# Altium project EEM_FMC_Carrier.PrjPCB (part 4 of 9)

## Sheet FPGA_Bank_0_Supplies.SchDoc: EEM FMC Carrier
size 420 x 297 mm; EDA_Number: ARTIQ; Projet: ARTIQ/Sinara; CheckedBy: -; CompanyName: WUT ISE; DrawnBy: Paweł Kulik; Organization: WUT ISE; Address1: Warsaw University of Technology; Address2: Nowowiejska 15/19 00-665 Warsaw; Address3: pawel.kulik@pw.edu.pl; DocumentNumber: 12; SheetNumber: 7; SheetTotal: 13; ModifiedBy: -; CheckedDate: -; Title2: FPGA power&caps + bank 0; DivGrp: ISE; Designer: Paweł Kulik; ModifiedDate: -; ProjectName: EEM_FMC_Carrier.PrjPCB
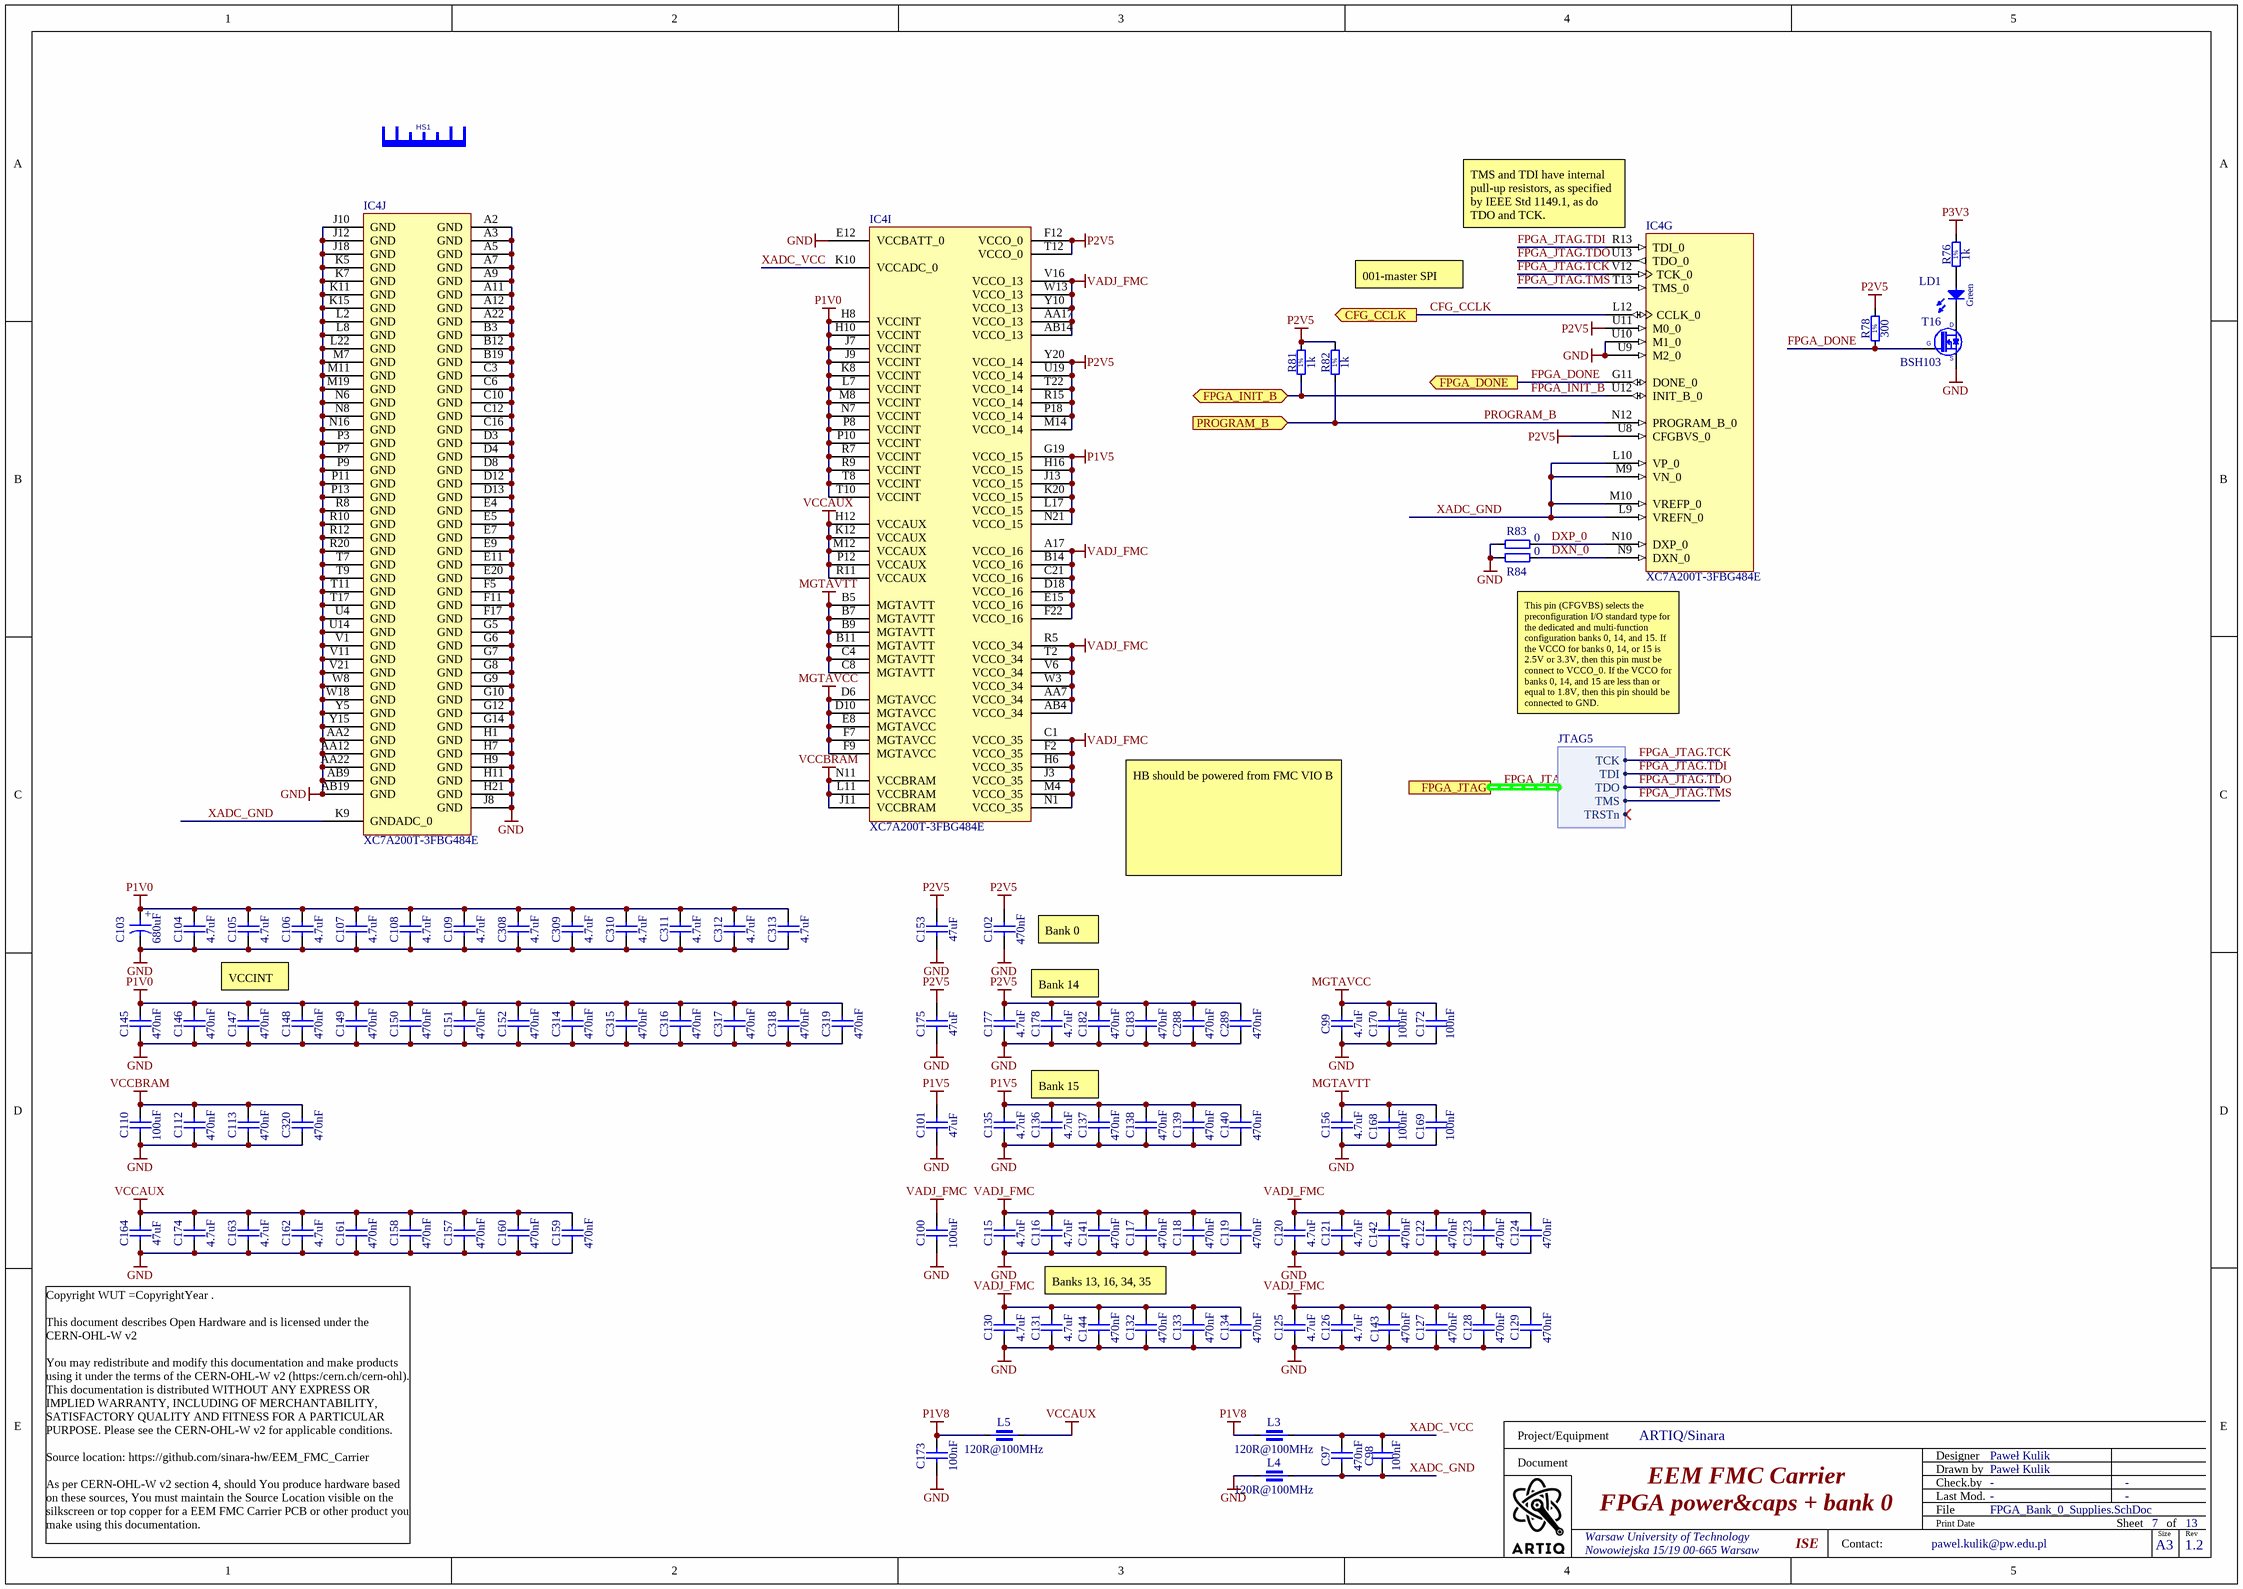
[diagram p5: FPGA_Bank_0_Supplies.SchDoc]

### Parts
C97  470nF  [CAPC0603X33N]
C98  100nF  [CAPC0603X33N]
C99  4.7uF  [CAPC1005X55N]
C100  100uF  [CAPC3216X180N]
C101  47uF  [CAPC1608X100N]
C102  470nF  [CAPC0603X33N]
C103  680uF  [CAPMP7343X430N]
C104  4.7uF  [CAPC1005X55N]
C105  4.7uF  [CAPC1005X55N]
C106  4.7uF  [CAPC1005X55N]
C107  4.7uF  [CAPC1005X55N]
C108  4.7uF  [CAPC1005X55N]
C109  4.7uF  [CAPC1005X55N]
C110  100uF  [CAPC3216X180N]
C112  470nF  [CAPC0603X33N]
C113  470nF  [CAPC0603X33N]
C115  4.7uF  [CAPC1005X55N]
C116  4.7uF  [CAPC1005X55N]
C117  470nF  [CAPC0603X33N]
C118  470nF  [CAPC0603X33N]
C119  470nF  [CAPC0603X33N]
C120  4.7uF  [CAPC1005X55N]
C121  4.7uF  [CAPC1005X55N]
C122  470nF  [CAPC0603X33N]
C123  470nF  [CAPC0603X33N]
C124  470nF  [CAPC0603X33N]
C125  4.7uF  [CAPC1005X55N]
C126  4.7uF  [CAPC1005X55N]
C127  470nF  [CAPC0603X33N]
C128  470nF  [CAPC0603X33N]
C129  470nF  [CAPC0603X33N]
C130  4.7uF  [CAPC1005X55N]
C131  4.7uF  [CAPC1005X55N]
C132  470nF  [CAPC0603X33N]
C133  470nF  [CAPC0603X33N]
C134  470nF  [CAPC0603X33N]
C135  4.7uF  [CAPC1005X55N]
C136  4.7uF  [CAPC1005X55N]
C137  470nF  [CAPC0603X33N]
C138  470nF  [CAPC0603X33N]
C139  470nF  [CAPC0603X33N]
C140  470nF  [CAPC0603X33N]
C141  470nF  [CAPC0603X33N]
C142  470nF  [CAPC0603X33N]
C143  470nF  [CAPC0603X33N]
C144  470nF  [CAPC0603X33N]
C145  470nF  [CAPC0603X33N]
C146  470nF  [CAPC0603X33N]
C147  470nF  [CAPC0603X33N]
C148  470nF  [CAPC0603X33N]
C149  470nF  [CAPC0603X33N]
C150  470nF  [CAPC0603X33N]
C151  470nF  [CAPC0603X33N]
C152  470nF  [CAPC0603X33N]
C153  47uF  [CAPC1608X100N]
C156  4.7uF  [CAPC1005X55N]
C157  470nF  [CAPC0603X33N]
C158  470nF  [CAPC0603X33N]
C159  470nF  [CAPC0603X33N]
C160  470nF  [CAPC0603X33N]
C161  470nF  [CAPC0603X33N]
C162  4.7uF  [CAPC1005X55N]
C163  4.7uF  [CAPC1005X55N]
C164  47uF  [CAPC1608X100N]
C168  100nF  [CAPC0603X33N]
C169  100nF  [CAPC0603X33N]
C170  100nF  [CAPC0603X33N]
C172  100nF  [CAPC0603X33N]
C173  100nF  [CAPC0603X33N]
C174  4.7uF  [CAPC1005X55N]
C175  47uF  [CAPC1608X100N]
C177  4.7uF  [CAPC1005X55N]
C178  4.7uF  [CAPC1005X55N]
C182  470nF  [CAPC0603X33N]
C183  470nF  [CAPC0603X33N]
C288  470nF  [CAPC0603X33N]
C289  470nF  [CAPC0603X33N]
C308  4.7uF  [CAPC1005X55N]
C309  4.7uF  [CAPC1005X55N]
C310  4.7uF  [CAPC1005X55N]
C311  4.7uF  [CAPC1005X55N]
C312  4.7uF  [CAPC1005X55N]
C313  4.7uF  [CAPC1005X55N]
C314  470nF  [CAPC0603X33N]
C315  470nF  [CAPC0603X33N]
C316  470nF  [CAPC0603X33N]
C317  470nF  [CAPC0603X33N]
C318  470nF  [CAPC0603X33N]
C319  470nF  [CAPC0603X33N]
C320  470nF  [CAPC0603X33N]
HS1  RADIAN_FI23  [RADIAN_FI23]  (value not drawn)
IC4  XC7A200T-3FBG484E  [BGA484C100P22X22_2300X2300X254]  (parts G,I,J of 10)
L3  120R@100MHz  [INDC1608X65N]
L4  120R@100MHz  [INDC1608X65N]
L5  120R@100MHz  [INDC1608X65N]
LD1  Green  [LED_KINGBRIGHT_KPH-1608CGCK]
R76  1k  [RESC1005X40N]
R78  300  [RESC1005X40N]
R81  1k  [RESC1005X40N]
R82  1k  [RESC1005X40N]
R83  0  [RESC0603X28N]
R84  0  [RESC0603X28N]
T16  BSH103  [SOT95P230X110-3N]

### Ports
CFG_CCLK (out), FPGA_DONE (out), FPGA_INIT_B (bidir), FPGA_JTAG (harness JTAG5), PROGRAM_B (in)

### Harnesses
JTAG5: TCK, TDI, TDO, TMS, TRSTn

### Nets
GND: C99.1 C100.1 C101.1 C102.1 C103.2 C104.1 C105.1 C106.1 C107.1 C108.1 C109.1 C110.1 C112.1 C113.1 C115.1 C116.1 C117.1 C118.1 C119.1 C120.1 C121.1 C122.1 C123.1 C124.1 C125.1 C126.1 C127.1 C128.1 C129.1 C130.1 C131.1 C132.1 C133.1 C134.1 C135.1 C136.1 C137.1 C138.1 C139.1 C140.1 C141.1 C142.1 C143.1 C144.1 C145.1 C146.1 C147.1 C148.1 C149.1 C150.1 C151.1 C152.1 C153.1 C156.1 C157.1 C158.1 C159.1 C160.1 C161.1 C162.1 C163.1 C164.1 C168.1 C169.1 C170.1 C172.1 C173.1 C174.1 C175.1 C177.1 C178.1 C182.1 C183.1 C288.1 C289.1 C308.1 C309.1 C310.1 C311.1 C312.1 C313.1 C314.1 C315.1 C316.1 C317.1 C318.1 C319.1 C320.1 IC4.A2(GND) IC4.A3(GND) IC4.A5(GND) IC4.A7(GND) IC4.A9(GND) IC4.A11(GND) IC4.A12(GND) IC4.A22(GND) IC4.AA2(GND) IC4.AA12(GND) IC4.AA22(GND) IC4.AB9(GND) IC4.AB19(GND) IC4.B3(GND) IC4.B12(GND) IC4.B19(GND) IC4.C3(GND) IC4.C6(GND) IC4.C10(GND) IC4.C12(GND) IC4.C16(GND) IC4.D3(GND) IC4.D4(GND) IC4.D8(GND) IC4.D12(GND) IC4.D13(GND) IC4.E4(GND) IC4.E5(GND) IC4.E7(GND) IC4.E9(GND) IC4.E11(GND) IC4.E12(VCCBATT_0) IC4.E20(GND) IC4.F5(GND) IC4.F11(GND) IC4.F17(GND) IC4.G5(GND) IC4.G6(GND) IC4.G7(GND) IC4.G8(GND) IC4.G9(GND) IC4.G10(GND) IC4.G12(GND) IC4.G14(GND) IC4.H1(GND) IC4.H7(GND) IC4.H9(GND) IC4.H11(GND) IC4.H21(GND) IC4.J8(GND) IC4.J10(GND) IC4.J12(GND) IC4.J18(GND) IC4.K5(GND) IC4.K7(GND) IC4.K11(GND) IC4.K15(GND) IC4.L2(GND) IC4.L8(GND) IC4.L22(GND) IC4.M7(GND) IC4.M11(GND) IC4.M19(GND) IC4.N6(GND) IC4.N8(GND) IC4.N16(GND) IC4.P3(GND) IC4.P7(GND) IC4.P9(GND) IC4.P11(GND) IC4.P13(GND) IC4.R8(GND) IC4.R10(GND) IC4.R12(GND) IC4.R20(GND) IC4.T7(GND) IC4.T9(GND) IC4.T11(GND) IC4.T17(GND) IC4.U4(GND) IC4.U9(M2_0) IC4.U10(M1_0) IC4.U14(GND) IC4.V1(GND) IC4.V11(GND) IC4.V21(GND) IC4.W8(GND) IC4.W18(GND) IC4.Y5(GND) IC4.Y15(GND) L4.1 R83.1 R84.1 T16.2(S)
MGTAVCC: C99.2 C170.2 C172.2 IC4.D6(MGTAVCC) IC4.D10(MGTAVCC) IC4.E8(MGTAVCC) IC4.F7(MGTAVCC) IC4.F9(MGTAVCC)
MGTAVTT: C156.2 C168.2 C169.2 IC4.B5(MGTAVTT) IC4.B7(MGTAVTT) IC4.B9(MGTAVTT) IC4.B11(MGTAVTT) IC4.C4(MGTAVTT) IC4.C8(MGTAVTT)
P1V0: C103.1 C104.2 C105.2 C106.2 C107.2 C108.2 C109.2 C145.2 C146.2 C147.2 C148.2 C149.2 C150.2 C151.2 C152.2 C308.2 C309.2 C310.2 C311.2 C312.2 C313.2 C314.2 C315.2 C316.2 C317.2 C318.2 C319.2 IC4.H8(VCCINT) IC4.H10(VCCINT) IC4.J7(VCCINT) IC4.J9(VCCINT) IC4.K8(VCCINT) IC4.L7(VCCINT) IC4.M8(VCCINT) IC4.N7(VCCINT) IC4.P8(VCCINT) IC4.P10(VCCINT) IC4.R7(VCCINT) IC4.R9(VCCINT) IC4.T8(VCCINT) IC4.T10(VCCINT)
P1V5: C101.2 C135.2 C136.2 C137.2 C138.2 C139.2 C140.2 IC4.G19(VCCO_15) IC4.H16(VCCO_15) IC4.J13(VCCO_15) IC4.K20(VCCO_15) IC4.L17(VCCO_15) IC4.N21(VCCO_15)
P1V8: C173.2 L3.1 L5.1
P2V5: C102.2 C153.2 C175.2 C177.2 C178.2 C182.2 C183.2 C288.2 C289.2 IC4.F12(VCCO_0) IC4.M14(VCCO_14) IC4.P18(VCCO_14) IC4.R15(VCCO_14) IC4.T12(VCCO_0) IC4.T22(VCCO_14) IC4.U8(CFGBVS_0) IC4.U11(M0_0) IC4.U19(VCCO_14) IC4.Y20(VCCO_14) R78.2 R81.2 R82.2
P3V3: R76.2
VADJ_FMC: C100.2 C115.2 C116.2 C117.2 C118.2 C119.2 C120.2 C121.2 C122.2 C123.2 C124.2 C125.2 C126.2 C127.2 C128.2 C129.2 C130.2 C131.2 C132.2 C133.2 C134.2 C141.2 C142.2 C143.2 C144.2 IC4.A17(VCCO_16) IC4.AA7(VCCO_34) IC4.AA17(VCCO_13) IC4.AB4(VCCO_34) IC4.AB14(VCCO_13) IC4.B14(VCCO_16) IC4.C1(VCCO_35) IC4.C21(VCCO_16) IC4.D18(VCCO_16) IC4.E15(VCCO_16) IC4.F2(VCCO_35) IC4.F22(VCCO_16) IC4.H6(VCCO_35) IC4.J3(VCCO_35) IC4.M4(VCCO_35) IC4.N1(VCCO_35) IC4.R5(VCCO_34) IC4.T2(VCCO_34) IC4.V6(VCCO_34) IC4.V16(VCCO_13) IC4.W3(VCCO_34) IC4.W13(VCCO_13) IC4.Y10(VCCO_13)
VCCAUX: C157.2 C158.2 C159.2 C160.2 C161.2 C162.2 C163.2 C164.2 C174.2 IC4.H12(VCCAUX) IC4.K12(VCCAUX) IC4.M12(VCCAUX) IC4.P12(VCCAUX) IC4.R11(VCCAUX) L5.2
VCCBRAM: C110.2 C112.2 C113.2 C320.2 IC4.J11(VCCBRAM) IC4.L11(VCCBRAM) IC4.N11(VCCBRAM)
CFG_CCLK: IC4.L12(CCLK_0) ; port CFG_CCLK
DXN_0: IC4.N9(DXN_0) R84.2
DXP_0: IC4.N10(DXP_0) R83.2
FPGA_DONE: IC4.G11(DONE_0) R78.1 T16.1(G) ; port FPGA_DONE
FPGA_INIT_B: IC4.U12(INIT_B_0) R81.1 ; port FPGA_INIT_B
FPGA_JTAG.TCK: IC4.V12(TCK_0) ; port FPGA_JTAG.TCK
FPGA_JTAG.TDI: IC4.R13(TDI_0) ; port FPGA_JTAG.TDI
FPGA_JTAG.TDO: IC4.U13(TDO_0) ; port FPGA_JTAG.TDO
FPGA_JTAG.TMS: IC4.T13(TMS_0) ; port FPGA_JTAG.TMS
PROGRAM_B: IC4.N12(PROGRAM_B_0) R82.1 ; port PROGRAM_B
XADC_GND: C97.1 C98.1 IC4.K9(GNDADC_0) IC4.L9(VREFN_0) IC4.L10(VP_0) IC4.M9(VN_0) IC4.M10(VREFP_0) L4.2
XADC_VCC: C97.2 C98.2 IC4.K10(VCCADC_0) L3.2
NetLD1_1: LD1.1(C) T16.3(D)
NetLD1_2: LD1.2(A) R76.1

### Buses and harness runs
harness FPGA_JTAG = port FPGA_JTAG

### Notes on the sheet
- (near IC4) TMS and TDI have internal pull-up resistors, as specified by IEEE Std 1149.1, as do TDO and TCK.
- 001-master SPI
- This pin (CFGVBS) selects the preconfiguration I/O standard type for the dedicated and multi-function configuration banks 0, 14, and 15. If the VCCO for banks 0, 14, or 15 is 2.5V or 3.3V, then this pin must be connect to VCCO_0. If the VCCO for banks 0, 14, and 15 are less than or equal to 1.8V, then this pin should be connected to GND.
- (near C102) Bank 0
- HB should be powered from FMC VIO B
- VCCINT
- Bank 14
- Bank 15
- Banks 13, 16, 34, 35
- Project/Equipment
- Document
- Designer
- Drawn by
- Check.by
- Copyright WUT =CopyrightYear .
  This document describes Open Hardware and is licensed under the CERN-OHL-W v2
  You may redistribute and modify this documentation and make products using it under the terms of the CERN-OHL-W v2 (https:/cern.ch/cern-ohl). This documentation is distributed WITHOUT ANY EXPRESS OR IMPLIED WARRANTY, INCLUDING OF MERCHANTABILITY, SATISFACTORY QUALITY AND FITNESS FOR A PARTICULAR PURPOSE. Please see the CERN-OHL-W v2 for applicable conditions.
  Source location: https://github.com/sinara-hw/EEM_FMC_Carrier
  As per CERN-OHL-W v2 section 4, should You produce hardware based on these sources, You must maintain the Source Location visible on the silkscreen or top copper for a EEM FMC Carrier PCB or other product you make using this documentation.
- Contact:
- File
- Last Mod.
- Print Date
- Sheet
- Size
- A3
- of
- Rev
- (in symbol CTE7343-43_680UF_6.3V_10%_LESR0018_AVX_TPM) +
- (in symbol R0402_1K_1%_0.0625W_100PPM) 1%
- (in symbol R0402_300R_1%_0.0625W_100PPM) 1%

### Library data of the parts
C97 C102 C112 C113 C117-C119 C122-C124 C127-C129 C132-C134 C137-C152 C157-C161 C182 C183 C288 C289 C314-C320 = CC0201_470NF_4V_20%_X5R: Non-polarised capacitor; Part Description: SMD Multilayer Chip Ceramic Capacitor; Manufacturer: GENERIC; Manufacturer1 Part Number: AMK063BJ474MP-F; Voltage: 4V; TC: X5R; Tolerance: ±20%; Part Number: CC0201_470NF_4V_20%_X5R; Component Kind: Standard; Component Type: Standard; Pin Count: 2; Value: 470nF; Status: Not Recommended; Manufacturer Part Number: CC0201_470NF_4V_20%_X5R; Case: 0201; Mounted: Yes; Socket: No; SMD: Yes; Sense: No; Manufacturer1 Example: TAIYO YUDEN; Manufacturer1 ComponentHeight: 0.33mm; HelpURL: \\cern.ch\dfs\Applications\Altium\Datasheets\CC0201_X5R_TAIYO-YUDEN_STANDARD-CLASS2.pdf; Author: CERN DEM JLC; CreateDate: 27.05.2010; LatestRevisionDate: 27.05.2010
  C113 C117 C122 C127 C132 C138 C148 C159 C183 C315 C320: ClassName: Artix
C98 C168-C170 C172 C173 = CC0201_100NF_6.3V_10%_X5R: as C33-C36 on sheet CLK_Distribution; Part Number: CC0201_100NF_6.3V_10%_X5R; Component Kind: Standard; Component Type: Standard; Pin Count: 2; Value: 100nF; Status: Not Recommended; Manufacturer Part Number: CC0201_100NF_6.3V_10%_X5R; Case: 0201; Mounted: Yes; Socket: No; SMD: Yes; Sense: No; Manufacturer1 Example: AVX; Manufacturer1 ComponentHeight: 0.33mm; HelpURL: \\cern.ch\dfs\Applications\Altium\Datasheets\CC0201_X5R_AVX.pdf; Author: CERN DEM JLC
  C98 C168-C170 C172: CreateDate: 2007-12-03; LatestRevisionDate: 2007-12-03; ClassName: Artix
  C173: CreateDate: 03.12.2007; LatestRevisionDate: 03.12.2007
C99 C156 C174 = CC0402_4.7UF_6.3V_20%_X5R: Non-polarised capacitor; Part Description: SMD Multilayer Chip Ceramic Capacitor; Manufacturer: GENERIC; Manufacturer1 Part Number: C1005X5R0J475M050BC; Voltage: 6.3V; TC: X5R; Tolerance: ±20%; Part Number: CC0402_4.7UF_6.3V_20%_X5R; Component Kind: Standard; Component Type: Standard; Pin Count: 2; Value: 4.7uF; Status: Preferred; Manufacturer Part Number: CC0402_4.7UF_6.3V_20%_X5R; Case: 0402; Mounted: Yes; Socket: No; SMD: Yes; Sense: No; Manufacturer1 Example: TDK; Manufacturer1 ComponentHeight: 0.65mm; HelpURL: \\cern.ch\dfs\Applications\Altium\Datasheets\CC0402_X5R_TDK_C.pdf; Author: CERN DEM JLC; CreateDate: 03.03.2015; LatestRevisionDate: 03.03.2015
C100 C110 = CC1206_100UF_6.3V_20%_X5R: Non-polarised capacitor; Part Description: SMD Multilayer Chip Ceramic Capacitor; Manufacturer: GENERIC; Manufacturer1 Part Number: C1206C107M9PACTU; Voltage: 6.3V; TC: X5R; Tolerance: ±10%; Part Number: CC1206_100UF_6.3V_20%_X5R; Component Kind: Standard; Component Type: Standard; Pin Count: 2; Value: 100uF; Status: None; Manufacturer Part Number: CC1206_100UF_6.3V_20%_X5R; Case: 1206; Mounted: Yes; Socket: No; SMD: Yes; Sense: No; Manufacturer1 Example: KEMET; Manufacturer1 ComponentHeight: 1.8mm; HelpURL: \\cern.ch\dfs\Applications\Altium\Datasheets\CC1206_X5R_KEMET.pdf; Author: CERN DEM JLC; CreateDate: 26.09.2012; LatestRevisionDate: 26.09.2012
C101 C153 C164 C175 = CC0603_47UF_6.3V_20%_X5R: Non-polarised capacitor; Part Description: SMD Multilayer Chip Ceramic Capacitor; Manufacturer: GENERIC; Manufacturer1 Part Number: GRM188R60J476ME15D; Voltage: 6.3V; TC: X5R; Tolerance: ±20%; Part Number: CC0603_47UF_6.3V_20%_X5R; Component Kind: Standard; Component Type: Standard; Pin Count: 2; Value: 47uF; Status: None; Manufacturer Part Number: CC0603_47UF_6.3V_20%_X5R; Case: 0603; Mounted: Yes; Socket: No; SMD: Yes; Sense: No; Manufacturer1 Example: MURATA; Manufacturer1 ComponentHeight: 1mm; HelpURL: \\cern.ch\dfs\Applications\Altium\Datasheets\CC0603_MURATA_GRM188R60J476ME15D.pdf; Author: CERN DEM JLC; CreateDate: 01.02.2018; LatestRevisionDate: 01.02.2018
C103 = CTE7343-43_680UF_6.3V_10%_LESR0018_AVX_TPM: Polarised capacitor; Part Description: Ultra Low ESR 0R018 Multianode Tantalum Chip Capacitor; Manufacturer: AVX; Manufacturer Part Number: TPME687K006R0018; Voltage: 6.3V; Tolerance: ±10%; Part Number: CTE7343-43_680UF_6.3V_10%_LESR0018_AVX_TPM; Component Kind: Standard; Component Type: Standard; Pin Count: 2; Value: 680uF; Status: None; Case: E; Mounted: Yes; Socket: No; SMD: Yes; Sense: No; ComponentHeight: 4.3mm; HelpURL: \\cern.ch\dfs\Applications\Altium\Datasheets\CTE_AVX_TPM.pdf; Author: CERN DEM JLC; CreateDate: 13.10.2011; LatestRevisionDate: 13.10.2011
C104-C109 C115 C116 C120 C121 C125 C126 C130 C131 C135 C136 C162 C163 C177 C178 C308-C313 = CC0402_4.7UF_6.3V_20%_X5R: Non-polarised capacitor; Manufacturer: GENERIC; Part Description: SMD Multilayer Chip Ceramic Capacitor; Manufacturer1 Part Number: C1005X5R0J475M050BC; Voltage: 6.3V; TC: X5R; Tolerance: ±20%; Part Number: CC0402_4.7UF_6.3V_20%_X5R; Component Kind: Standard; Component Type: Standard; Pin Count: 2; Value: 4.7uF; Status: Preferred; Manufacturer Part Number: CC0402_4.7UF_6.3V_20%_X5R; Case: 0402; Mounted: Yes; Socket: No; SMD: Yes; Sense: No; Manufacturer1 Example: TDK; Manufacturer1 ComponentHeight: 0.65mm; HelpURL: \\cern.ch\dfs\Applications\Altium\Datasheets\CC0402_X5R_TDK_C.pdf; Author: CERN DEM JLC; CreateDate: 03.03.2015; LatestRevisionDate: 03.03.2015
HS1 = RADIAN_FI23: Heat Sink Without Pad; Manufacturer: Radian Thermal Products, Inc.; Manufacturer Part Number: FI23+BU+T725; Part Description: 23 x 23 x 16 mm, clip on heatsink with fan for IC design BGA and others; ComponentHeight: 16 mm; HelpURL: https://www.radianheatsinks.com/product/fi23/
IC4 = XC7A200T-3FBG484E: Artix-7 FPGA, 285 User I/Os, 4 GTP, 484-Ball BGA, Pb-Free; Manufacturer Part Number: XC7A200T-3FBG484E; Device: XC7A200T-3FBG484E
L3-L5 = IND0603_MURATA_BLM18SG121TN1D: Part Description: SMD EMIFIL Suppression Chip Ferrite Bead; Manufacturer: MURATA; Power: 3A; Resistance: 0.025R; Tolerance: ±25%; Part Number: IND0603_MURATA_BLM18SG121TN1D; Component Kind: Standard; Component Type: Standard; Pin Count: 2; Value: 120R@100MHz; Status: None; Manufacturer Part Number: BLM18SG121TN1D; Case: 0603; Mounted: Yes; Socket: No; SMD: Yes; Sense: No; ComponentHeight: 0.65mm; HelpURL: \\cern.ch\dfs\Applications\Altium\Datasheets\IND0603_MURATA_BLM18S.pdf; Author: CERN DEM JLC; CreateDate: 23.07.2014; LatestRevisionDate: 25.10.2018
LD1 = LED_KINGBRIGHT_KPH-1608CGCK: LED Green 1C 2A; Part Description: SMD Green LED, Case 1.6mmX0.8mm(0603), 0.65mm Thickness; PressFit: No; Bonding: No; Manufacturer Part Number: KPH-1608CGCK; ComponentHeight: 0.65mm; HelpURL: \\cern.ch\dfs\Applications\Altium\Datasheets\LED_KINGBRIGHT_KPH-1608CGCK.pdf; Part Number: LED_KINGBRIGHT_KPH-1608CGCK; Component Kind: Standard; Component Type: Standard; Color: Green; PackageDescription: SMT Green LED, Case 0603, Body L 1.6 x W 0.8mm H 0.65mm; Manufacturer: KINGBRIGHT; Pin Count: 2; Mounted: Yes; Socket: No; SMD: Yes; Sense: No; Author: CERN DEM JLC; CreateDate: 03.07.2017; LatestRevisionDate: 03.07.2017
R76 R81 R82 = R0402_1K_1%_0.0625W_100PPM: Resistor - 1%; Part Description: General Purpose Thick Film Chip Resistor; Manufacturer: GENERIC; Manufacturer1 Part Number: 232270671002L; TC: ±100ppm/°C; PressFit: No; Part Number: R0402_1K_1%_0.0625W_100PPM; Component Kind: Standard; Component Type: Standard; Pin Count: 2; Value: 1k; Status: Not Recommended; Power: 0.0625W; Tolerance: ±1%; Manufacturer Part Number: R0402_1K_1%_0.0625W_100PPM; Case: 0402; Mounted: Yes; Sense: No; Socket: No; SMD: Yes; Manufacturer1 Example: YAGEO PHYCOMP; Manufacturer1 ComponentHeight: 0.4mm; HelpURL: \\cern.ch\dfs\Applications\Altium\Datasheets\R0402_Phycomp_RC0402.pdf; Author: CERN DEM JLC; CreateDate: 03.12.2007; LatestRevisionDate: 17.10.2012; ClassName: Artix
R78 = R0402_300R_1%_0.0625W_100PPM: Resistor - 1%; Part Description: General Purpose Thick Film Chip Resistor; Manufacturer: GENERIC; Manufacturer1 Part Number: 232270673001L; TC: ±100ppm/°C; PressFit: No; Part Number: R0402_300R_1%_0.0625W_100PPM; Component Kind: Standard; Component Type: Standard; Pin Count: 2; Value: 300; Status: Not Recommended; Power: 0.0625W; Tolerance: ±1%; Manufacturer Part Number: R0402_300R_1%_0.0625W_100PPM; Case: 0402; Mounted: Yes; Sense: No; Socket: No; SMD: Yes; Manufacturer1 Example: YAGEO PHYCOMP; Manufacturer1 ComponentHeight: 0.4mm; HelpURL: \\cern.ch\dfs\Applications\Altium\Datasheets\R0402_Phycomp_RC0402.pdf; Author: CERN DEM JLC; CreateDate: 03.12.2007; LatestRevisionDate: 17.10.2012
R83 R84 = R0201_0R_JUMPER: Resistor; Part Description: 1A (0.05R Max DC Resistance) Zero Ohm Jumper; Manufacturer: GENERIC; Manufacturer1 Part Number: CRCW02010000Z0ED; PressFit: No; Part Number: R0201_0R_JUMPER; Component Kind: Standard; Component Type: Standard; Pin Count: 2; Value: 0; Status: Not Recommended; Manufacturer Part Number: R0201_0R_JUMPER; Case: 0201; Mounted: Yes; Sense: No; Socket: No; SMD: Yes; Manufacturer1 Example: VISHAY; Manufacturer1 ComponentHeight: 0.27mm; HelpURL: \\cern.ch\dfs\Applications\Altium\Datasheets\R0201_VISHAY_CRCW e3.pdf; Author: CERN DEM JLC; CreateDate: 19.11.2014; LatestRevisionDate: 08.01.2015
T16 = BSH103: N-CHANNEL MOSFET WITH DIODE; Part Description: 30V 850mA N-Channel Enhancement Mode Field-Effect Transistor; Manufacturer: NEXPERIA; PressFit: No; Bonding: No; Part Number: BSH103; Component Kind: Standard; Component Type: Standard; Device: BSH103; PackageDescription: SOT23, 0.95mm Pitch; 3 Pin, 1.30mm W X 2.90mm L X 1.10mm H body, IPC Medium Density; Manufacturer Part Number: BSH103; Pin Count: 3; Case: SOT23-3; Mounted: Yes; Socket: No; SMD: Yes; Sense: No; ComponentHeight: 1.1mm; HelpURL: \\cern.ch\dfs\Applications\Altium\Datasheets\BSH103.pdf; Author: CERN DEM JLC; CreateDate: 16.03.2010; LatestRevisionDate: 20.06.2017

## Sheet FPGA_GTP.SchDoc: EEM FMC Carrier
size 420 x 297 mm; EDA_Number: ARTIQ; Projet: ARTIQ/Sinara; CheckedBy: -; CompanyName: WUT ISE; DrawnBy: Paweł Kulik; Organization: WUT ISE; Address1: Warsaw University of Technology; Address2: Nowowiejska 15/19 00-665 Warsaw; Address3: pawel.kulik@pw.edu.pl; DocumentNumber: 13; SheetNumber: 4; SheetTotal: 13; CheckedDate: -; Title2: FPGA GTP; DivGrp: ISE; Designer: Paweł Kulik; ModifiedDate: -; ProjectName: EEM_FMC_Carrier.PrjPCB
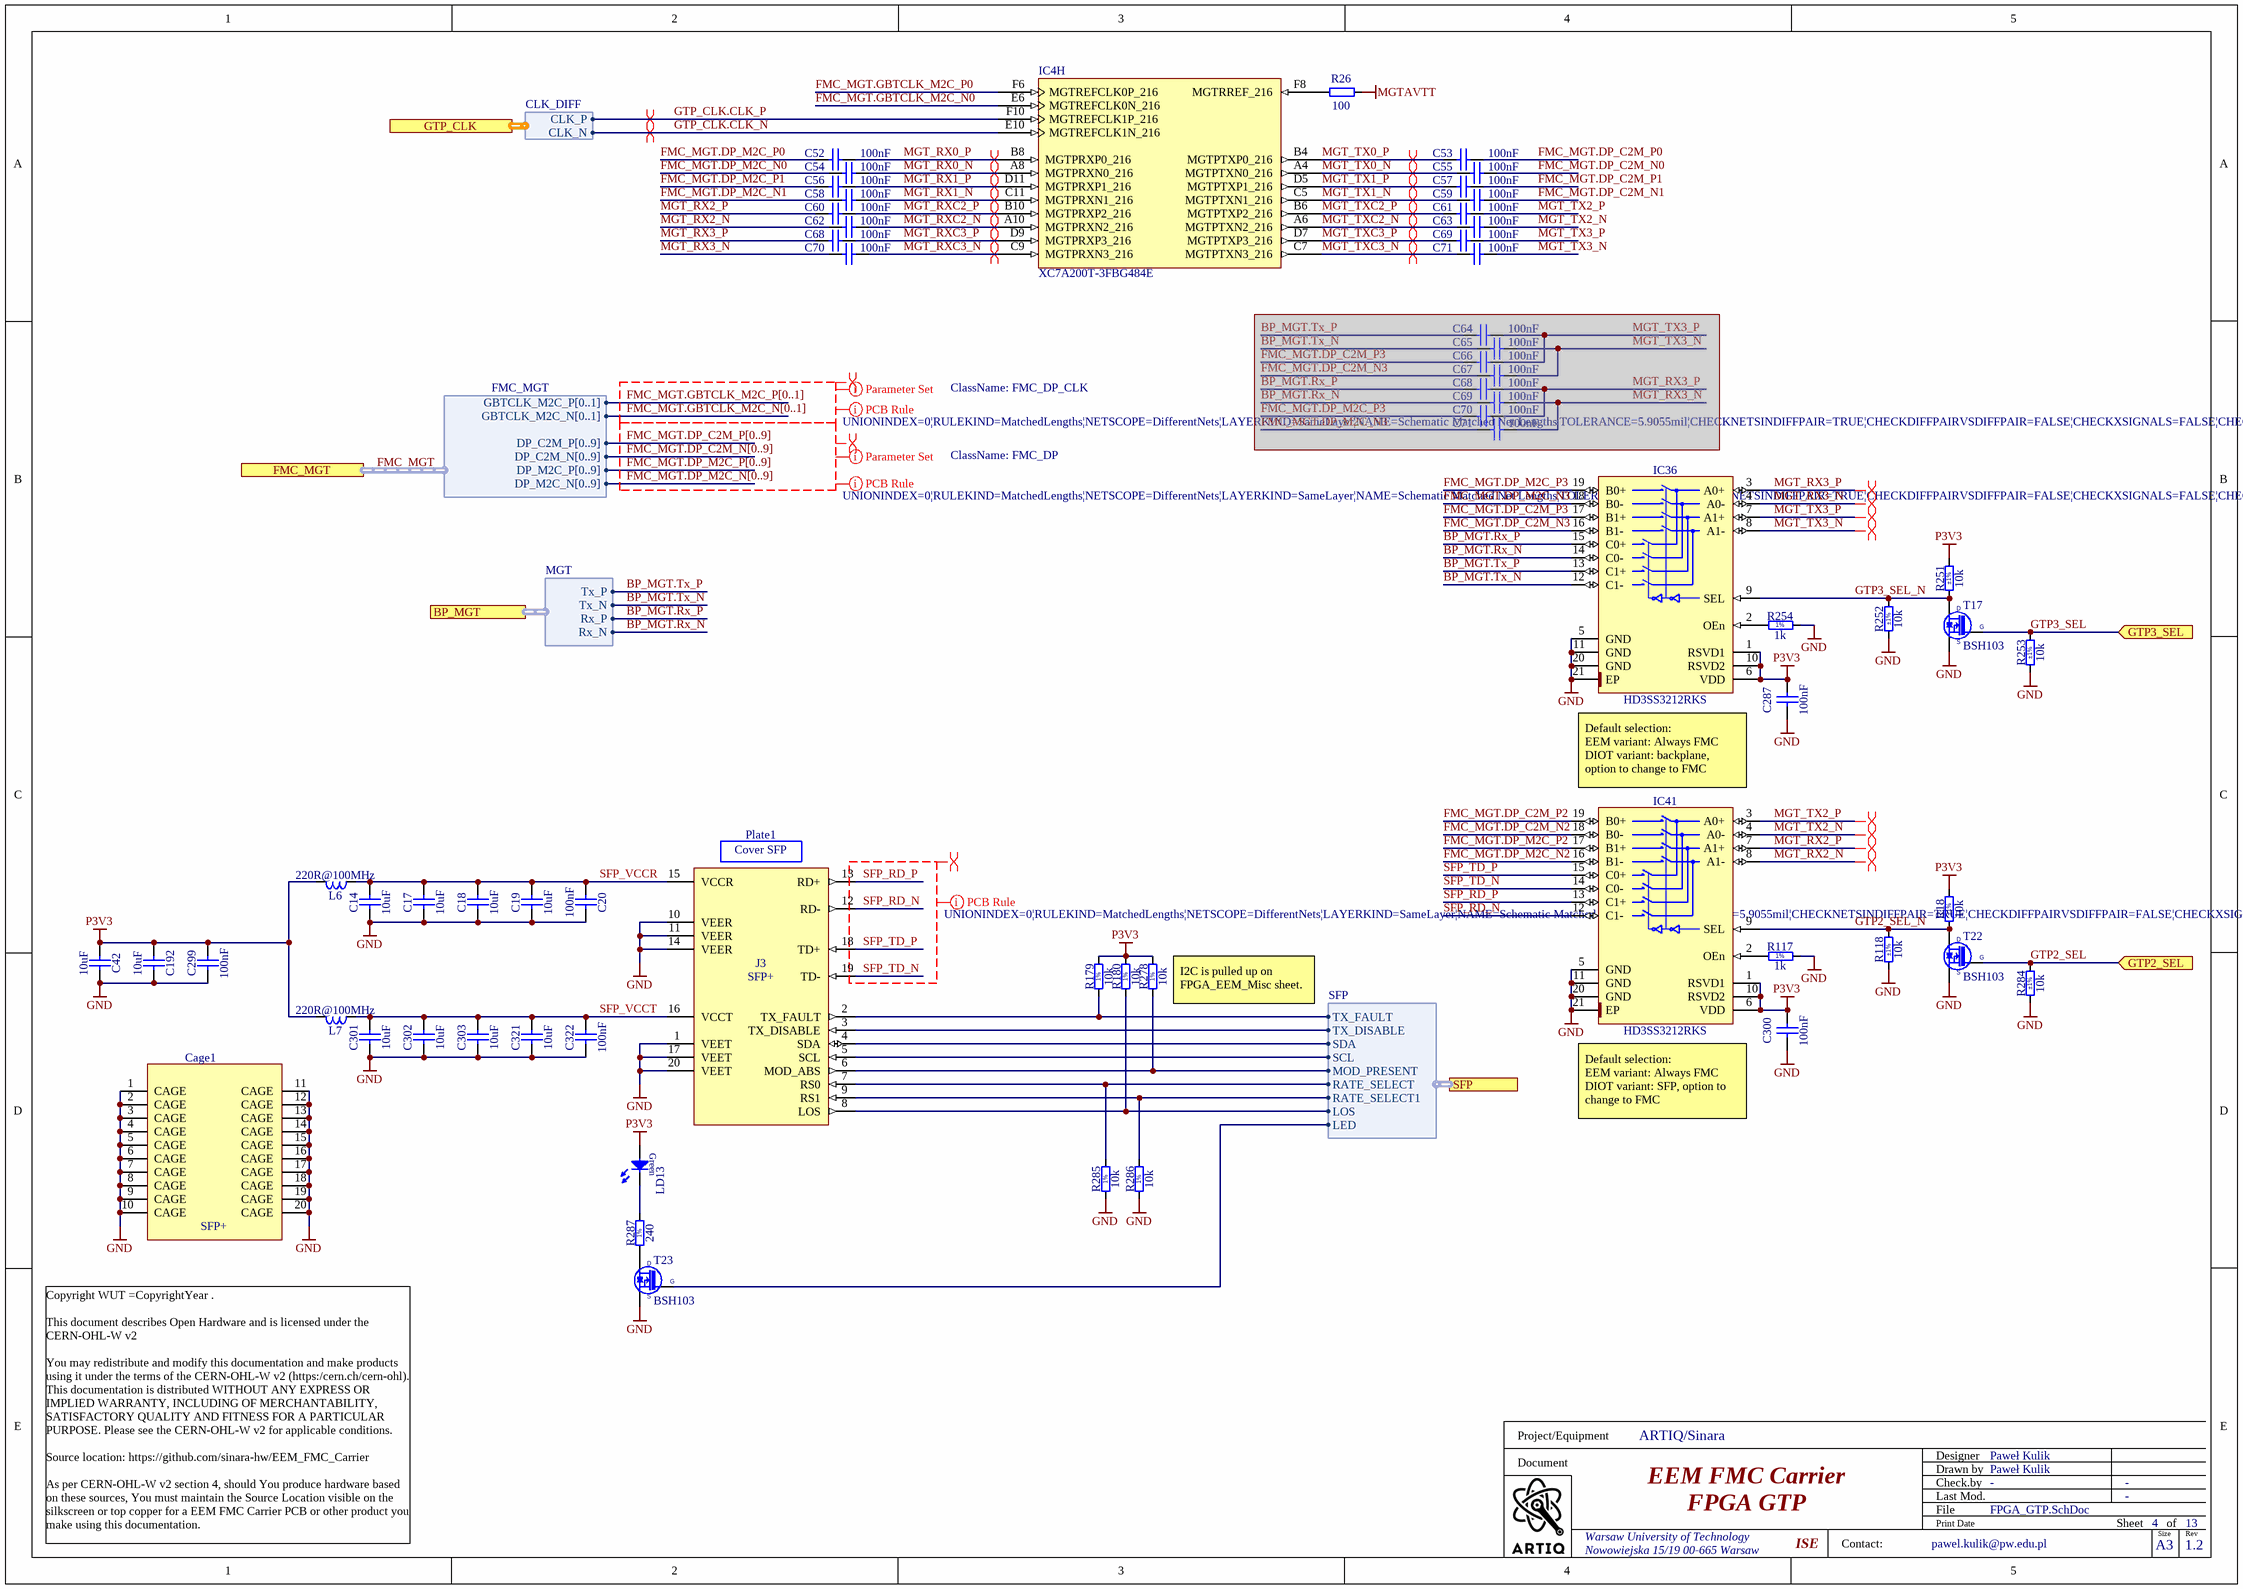
[diagram p6: FPGA_GTP.SchDoc]

### Parts
(Parts that share a designator on the sheet are numbered #1, #2 ... from top to bottom, then left to right.)
C14  10uF  [CAPC1005X70N]
C17  10uF  [CAPC1005X70N]
C18  10uF  [CAPC1005X70N]
C19  10uF  [CAPC1005X70N]
C20  100nF  [CAPC1005X55N]
C42  10uF  [CAPC1005X70N]
C52  100nF  [CAPC0603X33N]
C53  100nF  [CAPC0603X33N]
C54  100nF  [CAPC0603X33N]
C55  100nF  [CAPC0603X33N]
C56  100nF  [CAPC0603X33N]
C57  100nF  [CAPC0603X33N]
C58  100nF  [CAPC0603X33N]
C59  100nF  [CAPC0603X33N]
C60  100nF  [CAPC0603X33N]
C61  100nF  [CAPC0603X33N]
C62  100nF  [CAPC0603X33N]
C63  100nF  [CAPC0603X33N]
C64#2  100nF  [CAPC0603X33N]  (masked out: inside a compile mask, not in the netlist)
C65#2  100nF  [CAPC0603X33N]  (masked out: inside a compile mask, not in the netlist)
C66#2  100nF  [CAPC0603X33N]  (masked out: inside a compile mask, not in the netlist)
C67#2  100nF  [CAPC0603X33N]  (masked out: inside a compile mask, not in the netlist)
C68#1  100nF  [CAPC0603X33N]
C68#2  100nF  [CAPC0603X33N]  (masked out: inside a compile mask, not in the netlist)
C69#1  100nF  [CAPC0603X33N]
C69#2  100nF  [CAPC0603X33N]  (masked out: inside a compile mask, not in the netlist)
C70#1  100nF  [CAPC0603X33N]
C70#2  100nF  [CAPC0603X33N]  (masked out: inside a compile mask, not in the netlist)
C71#1  100nF  [CAPC0603X33N]
C71#2  100nF  [CAPC0603X33N]  (masked out: inside a compile mask, not in the netlist)
C192  10uF  [CAPC1005X70N]
C287  100nF  [CAPC1005X55N]
C299  100nF  [CAPC1005X55N]
C300  100nF  [CAPC1005X55N]
C301  10uF  [CAPC1005X70N]
C302  10uF  [CAPC1005X70N]
C303  10uF  [CAPC1005X70N]
C321  10uF  [CAPC1005X70N]
C322  100nF  [CAPC1005X55N]
Cage1  SFP+  [TYCO_2007198-1]
IC4  XC7A200T-3FBG484E  [BGA484C100P22X22_2300X2300X254]  (part H of 10)
IC36  HD3SS3212RKS  [TEXAS_RKS0020A]
IC41  HD3SS3212RKS  [TEXAS_RKS0020A]
J3  SFP+  [TYCO_1888247-1]
L6  220R@100MHz  [INDC2012X105N]
L7  220R@100MHz  [INDC2012X105N]
LD13  Green  [LED_AVAGO_HSME-C120]  (value not drawn)
Plate1  Cover SFP  [AMPHENOL_U77A11108000P]
R18  10k  Tolerance: ±1%  [RESC1005X40N]
R26  100  [RESC0603X28N]
R117  1k  [RESC1005X40N]
R118  10k  Tolerance: ±1%  [RESC1005X40N]
R179  10k  [RESC1005X40N]
R180  10k  [RESC1005X40N]
R251  10k  Tolerance: ±1%  [RESC1005X40N]
R252  10k  Tolerance: ±1%  [RESC1005X40N]
R253  10k  Tolerance: ±1%  [RESC1005X40N]
R254  1k  [RESC1005X40N]
R278  10k  [RESC1005X40N]
R284  10k  Tolerance: ±1%  [RESC1005X40N]
R285  10k  [RESC1005X40N]
R286  10k  [RESC1005X40N]
R287  240  [RESC1005X40N]
T17  BSH103  [SOT95P230X110-3N]
T22  BSH103  [SOT95P230X110-3N]
T23  BSH103  [SOT95P230X110-3N]

### Ports
BP_MGT (harness MGT), FMC_MGT (harness FMC_MGT), GTP2_SEL (in), GTP3_SEL (in), GTP_CLK (harness CLK_DIFF), SFP (harness SFP)

### Harnesses
FMC_MGT: GBTCLK_M2C_P[0..1], GBTCLK_M2C_N[0..1], DP_C2M_P[0..9], DP_C2M_N[0..9], DP_M2C_N[0..9], DP_M2C_P[0..9]
MGT: Tx_P, Tx_N, Rx_P, Rx_N
CLK_DIFF: CLK_P, CLK_N
SFP: TX_FAULT, LOS, MOD_PRESENT, TX_DISABLE, RATE_SELECT, LED, RATE_SELECT1, SDA, SCL

### Nets
GND: C14.1 C17.1 C18.1 C19.1 C20.2 C42.1 C192.1 C287.1 C299.2 C300.1 C301.1 C302.1 C303.1 C321.1 C322.2 Cage1.1(CAGE) Cage1.2(CAGE) Cage1.3(CAGE) Cage1.4(CAGE) Cage1.5(CAGE) Cage1.6(CAGE) Cage1.7(CAGE) Cage1.8(CAGE) Cage1.9(CAGE) Cage1.10(CAGE) Cage1.11(CAGE) Cage1.12(CAGE) Cage1.13(CAGE) Cage1.14(CAGE) Cage1.15(CAGE) Cage1.16(CAGE) Cage1.17(CAGE) Cage1.18(CAGE) Cage1.19(CAGE) Cage1.20(CAGE) IC36.5(GND) IC36.11(GND) IC36.20(GND) IC36.21(EP) IC41.5(GND) IC41.11(GND) IC41.20(GND) IC41.21(EP) J3.1(VEET) J3.10(VEER) J3.11(VEER) J3.14(VEER) J3.17(VEET) J3.20(VEET) R117.2 R118.1 R252.1 R253.1 R254.2 R284.1 R285.1 R286.1 T17.2(S) T22.2(S) T23.2(S)
MGTAVTT: R26.1
P3V3: C42.2 C192.2 C287.2 C299.1 C300.2 IC36.1(RSVD1) IC36.6(VDD) IC36.10(RSVD2) IC41.1(RSVD1) IC41.6(VDD) IC41.10(RSVD2) L6.2 L7.2 LD13.2(A) R18.2 R179.2 R180.2 R251.2 R278.2
Board_I2C.SCL: J3.4(SDA) ; port SFP.SDA
Board_I2C.SDA: J3.5(SCL) ; port SFP.SCL
BP_MGT.Rx_N: IC36.14(C0-) ; port BP_MGT.Rx_N
BP_MGT.Rx_P: IC36.15(C0+) ; port BP_MGT.Rx_P
BP_MGT.Tx_N: IC36.12(C1-) ; port BP_MGT.Tx_N
BP_MGT.Tx_P: IC36.13(C1+) ; port BP_MGT.Tx_P
FMC_MGT.DP_C2M_N0: C55.2
FMC_MGT.DP_C2M_N1: C59.2
FMC_MGT.DP_C2M_N2: IC41.18(B0-)
FMC_MGT.DP_C2M_N3: IC36.16(B1-)
FMC_MGT.DP_C2M_P0: C53.2
FMC_MGT.DP_C2M_P1: C57.2
FMC_MGT.DP_C2M_P2: IC41.19(B0+)
FMC_MGT.DP_C2M_P3: IC36.17(B1+)
FMC_MGT.DP_M2C_N0: C54.1
FMC_MGT.DP_M2C_N1: C58.1
FMC_MGT.DP_M2C_N2: IC41.16(B1-)
FMC_MGT.DP_M2C_N3: IC36.18(B0-)
FMC_MGT.DP_M2C_P0: C52.1
FMC_MGT.DP_M2C_P1: C56.1
FMC_MGT.DP_M2C_P2: IC41.17(B1+)
FMC_MGT.DP_M2C_P3: IC36.19(B0+)
FMC_MGT.GBTCLK_M2C_N0: IC4.E6(MGTREFCLK0N_216)
FMC_MGT.GBTCLK_M2C_P0: IC4.F6(MGTREFCLK0P_216)
GTP2_SEL: R284.2 T22.1(G) ; port GTP2_SEL
GTP2_SEL_N: IC41.9(SEL) R18.1 R118.2 T22.3(D)
GTP3_SEL: R253.2 T17.1(G) ; port GTP3_SEL
GTP3_SEL_N: IC36.9(SEL) R251.1 R252.2 T17.3(D)
GTP_CLK.CLK_N: IC4.E10(MGTREFCLK1N_216) ; port GTP_CLK.CLK_N
GTP_CLK.CLK_P: IC4.F10(MGTREFCLK1P_216) ; port GTP_CLK.CLK_P
MGT_RX0_N: C54.2 IC4.A8(MGTPRXN0_216)
MGT_RX0_P: C52.2 IC4.B8(MGTPRXP0_216)
MGT_RX1_N: C58.2 IC4.C11(MGTPRXN1_216)
MGT_RX1_P: C56.2 IC4.D11(MGTPRXP1_216)
MGT_RX2_N: C62.1 IC41.8(A1-)
MGT_RX2_P: C60.1 IC41.7(A1+)
MGT_RX3_N: C70#1.1 IC36.4(A0-)
MGT_RX3_P: C68#1.1 IC36.3(A0+)
MGT_RXC2_N: C62.2 IC4.A10(MGTPRXN2_216)
MGT_RXC2_P: C60.2 IC4.B10(MGTPRXP2_216)
MGT_RXC3_N: C70#1.2 IC4.C9(MGTPRXN3_216)
MGT_RXC3_P: C68#1.2 IC4.D9(MGTPRXP3_216)
MGT_TX0_N: C55.1 IC4.A4(MGTPTXN0_216)
MGT_TX0_P: C53.1 IC4.B4(MGTPTXP0_216)
MGT_TX1_N: C59.1 IC4.C5(MGTPTXN1_216)
MGT_TX1_P: C57.1 IC4.D5(MGTPTXP1_216)
MGT_TX2_N: C63.2 IC41.4(A0-)
MGT_TX2_P: C61.2 IC41.3(A0+)
MGT_TX3_N: C71#1.2 IC36.8(A1-)
MGT_TX3_P: C69#1.2 IC36.7(A1+)
MGT_TXC2_N: C63.1 IC4.A6(MGTPTXN2_216)
MGT_TXC2_P: C61.1 IC4.B6(MGTPTXP2_216)
MGT_TXC3_N: C71#1.1 IC4.C7(MGTPTXN3_216)
MGT_TXC3_P: C69#1.1 IC4.D7(MGTPTXP3_216)
SFP.LED: T23.1(G) ; port SFP.LED
SFP.LOS: J3.8(LOS) R180.1 ; port SFP.LOS
SFP.MOD_PRESENT: J3.6(MOD_ABS) R278.1 ; port SFP.MOD_PRESENT
SFP.RATE_SELECT: J3.7(RS0) R285.2 ; port SFP.RATE_SELECT
SFP.RATE_SELECT1: J3.9(RS1) R286.2 ; port SFP.RATE_SELECT1
SFP.TX_DISABLE: J3.3(TX_DISABLE) ; port SFP.TX_DISABLE
SFP.TX_FAULT: J3.2(TX_FAULT) R179.1 ; port SFP.TX_FAULT
SFP_RD_N: IC41.12(C1-) J3.12(RD-)
SFP_RD_P: IC41.13(C1+) J3.13(RD+)
SFP_TD_N: IC41.14(C0-) J3.19(TD-)
SFP_TD_P: IC41.15(C0+) J3.18(TD+)
SFP_VCCR: C14.2 C17.2 C18.2 C19.2 C20.1 J3.15(VCCR) L6.1
SFP_VCCT: C301.2 C302.2 C303.2 C321.2 C322.1 J3.16(VCCT) L7.1
NetIC4_F8: IC4.F8(MGTRREF_216) R26.2
NetIC36_2: IC36.2(OEn) R254.1
NetIC41_2: IC41.2(OEn) R117.1
NetLD13_1: LD13.1(C) R287.2
NetR287_1: R287.1 T23.3(D)

### Buses and harness runs
bus FMC_MGT.DP_C2M_N[0..9]
bus FMC_MGT.DP_C2M_P[0..9]
bus FMC_MGT.DP_M2C_N[0..9]
bus FMC_MGT.DP_M2C_P[0..9]
bus FMC_MGT.GBTCLK_M2C_N[0..1]
bus FMC_MGT.GBTCLK_M2C_P[0..1]
harness FMC_MGT = port FMC_MGT

### Layout directives
differential pair; differential pair class MGT: FMC_MGT.DP_C2M_N[0..9], FMC_MGT.DP_C2M_P[0..9], FMC_MGT.DP_M2C_N[0..9], FMC_MGT.DP_M2C_P[0..9], MGT_RX0_N, MGT_RX0_P, MGT_RX1_N, MGT_RX1_P, MGT_RX2_N, MGT_RX2_P, MGT_RX3_N, MGT_RX3_P, MGT_RXC2_N, MGT_RXC2_P, MGT_RXC3_N, MGT_RXC3_P, MGT_TX0_N, MGT_TX0_P, MGT_TX1_N, MGT_TX1_P, MGT_TX2_N, MGT_TX2_P, MGT_TX3_N, MGT_TX3_P, MGT_TXC2_N, MGT_TXC2_P, MGT_TXC3_N, MGT_TXC3_P, SFP_RD_N, SFP_RD_P, SFP_TD_N, SFP_TD_P
net class FMC_DP: FMC_MGT.DP_C2M_N[0..9], FMC_MGT.DP_C2M_P[0..9], FMC_MGT.DP_M2C_N[0..9], FMC_MGT.DP_M2C_P[0..9]
rule Matched Net Lengths [Delay Tolerance = 1ps]: FMC_MGT.DP_C2M_N[0..9], FMC_MGT.DP_C2M_P[0..9], FMC_MGT.DP_M2C_N[0..9], FMC_MGT.DP_M2C_P[0..9], SFP_RD_N, SFP_RD_P, SFP_TD_N, SFP_TD_P
differential pair; differential pair class Diff_100Ohm: FMC_MGT.GBTCLK_M2C_N[0..1], FMC_MGT.GBTCLK_M2C_P[0..1]
net class FMC_DP_CLK: FMC_MGT.GBTCLK_M2C_N[0..1], FMC_MGT.GBTCLK_M2C_P[0..1]
rule Matched Net Lengths [Delay Tolerance = 11ps]: FMC_MGT.GBTCLK_M2C_N[0..1], FMC_MGT.GBTCLK_M2C_P[0..1]
differential pair: GTP_CLK.CLK_N, GTP_CLK.CLK_P

### Notes on the sheet
- Default selection:
  EEM variant: Always FMC
  DIOT variant: backplane, option to change to FMC
- (near R278) I2C is pulled up on FPGA_EEM_Misc sheet.
- Default selection:
  EEM variant: Always FMC
  DIOT variant: SFP, option to change to FMC
- Project/Equipment
- Document
- Designer
- Drawn by
- Check.by
- Copyright WUT =CopyrightYear .
  This document describes Open Hardware and is licensed under the CERN-OHL-W v2
  You may redistribute and modify this documentation and make products using it under the terms of the CERN-OHL-W v2 (https:/cern.ch/cern-ohl). This documentation is distributed WITHOUT ANY EXPRESS OR IMPLIED WARRANTY, INCLUDING OF MERCHANTABILITY, SATISFACTORY QUALITY AND FITNESS FOR A PARTICULAR PURPOSE. Please see the CERN-OHL-W v2 for applicable conditions.
  Source location: https://github.com/sinara-hw/EEM_FMC_Carrier
  As per CERN-OHL-W v2 section 4, should You produce hardware based on these sources, You must maintain the Source Location visible on the silkscreen or top copper for a EEM FMC Carrier PCB or other product you make using this documentation.
- Contact:
- File
- Last Mod.
- Print Date
- Sheet
- Size
- A3
- of
- Rev
- (in symbol R0402_1K_1%_0.0625W_100PPM) 1%
- (in symbol R0402_10K_1%_0.0625W_100PPM) 1%
- (in symbol R0402_240R_1%_0.0625W_100PPM) 1%

### Library data of the parts
C14 C17-C19 C42 C192 C301-C303 C321 = CC0402_10UF_6.3V_20%_X5R: Non-polarised capacitor; Part Description: SMD Multilayer Chip Ceramic Capacitor; Manufacturer: GENERIC; Manufacturer1 Part Number: C1005X5R0J106M050BC; Voltage: 6.3V; TC: X5R; Tolerance: ±10%; Part Number: CC0402_10UF_6.3V_20%_X5R; Component Kind: Standard; Component Type: Standard; Pin Count: 2; Value: 10uF; Status: Preferred; Manufacturer Part Number: CC0402_10UF_6.3V_20%_X5R; Case: 0402; Mounted: Yes; Socket: No; SMD: Yes; Manufacturer1 Example: TDK; Manufacturer1 ComponentHeight: 0.70mm; HelpURL: \\cern.ch\dfs\Applications\Altium\Datasheets\CC0402_X5R_TDK_C.pdf; Author: CERN DEM JLC; CreateDate: 07.01.2015; LatestRevisionDate: 07.01.2015; Sense: No
C20 C287 C299 C300 C322 = CC0402_100NF_25V_10%_X7R_YUDEN_TMK105B7104KVHF: Non-polarised capacitor; Part Description: SMD Multilayer Chip Ceramic Capacitor (High Dielectric Type) for Automotive / Industrial Applications; Manufacturer: TAIYO YUDEN; Voltage: 25V; TC: X7R; Tolerance: ±10%; Part Number: CC0402_100NF_25V_10%_X7R_YUDEN_TMK105B7104KVHF; Component Kind: Standard; Component Type: Standard; Pin Count: 2; Value: 100nF; Status: Not Recommended; Manufacturer Part Number: TMK105B7104KVHF; Case: 0402; Mounted: Yes; Socket: No; SMD: Yes; HelpURL: \\cern.ch\dfs\Applications\Altium\Datasheets\CC0402_TAIYO-YUDEN_TMK105B7104KVHF.pdf; Author: CERN DEM JLC; CreateDate: 10-May-17; LatestRevisionDate: 10-May-17; Sense: No; ComponentHeight: 0.55mm
C52-C63 C64#2 C65#2 C66#2 C67#2 C68#1 C68#2 C69#1 C69#2 C70#1 C70#2 C71#1 C71#2 = CC0201_100NF_6.3V_10%_X5R: as C33-C36 on sheet CLK_Distribution; Part Number: CC0201_100NF_6.3V_10%_X5R; Component Kind: Standard; Component Type: Standard; Pin Count: 2; Value: 100nF; Status: Not Recommended; Manufacturer Part Number: CC0201_100NF_6.3V_10%_X5R; Case: 0201; Mounted: Yes; Socket: No; SMD: Yes; Manufacturer1 Example: AVX; Manufacturer1 ComponentHeight: 0.33mm; HelpURL: \\cern.ch\dfs\Applications\Altium\Datasheets\CC0201_X5R_AVX.pdf; Author: CERN DEM JLC; CreateDate: 2007-12-03; LatestRevisionDate: 2007-12-03; Sense: No
Cage1 = TYCO_2007198-1: SFP+ 1x1 Cage (20Pins); Part Description: 1x1 Press Fit Cage For Use with SFP+ Connector (Small Form-factor Pluggable); Manufacturer: TYCO ELECTRONICS; Part Number: TYCO_2007198-1; Component Kind: Standard; Component Type: Standard; Pin Count: 20; Family: SFP+; Mounted: Yes; Socket: No; SMD: No; PressFit: Yes; Status: None; Manufacturer Part Number: 2007198-1; ComponentHeight: 9.7mm; HelpURL: \\cern.ch\dfs\Applications\Altium\Datasheets\TYCO_2007198-1.pdf; Author: CERN DEM JLC; CreateDate: 04-Jun-13; LatestRevisionDate: 12-Jun-13; Sense: No
IC4 = XC7A200T-3FBG484E: as IC4 on sheet FPGA_Bank_0_Supplies; Manufacturer Part Number: XC7A200T-3FBG484E; Device: XC7A200T-3FBG484E
IC36 IC41 = HD3SS3212RKS: Two-Channel Differential 2:1/1:2 USB3.1 Mux/Demux; Manufacturer: TEXAS INSTRUMENTS; PressFit: No; Bonding: No; Part Number: HD3SS3212RKS; Component Kind: Standard; Component Type: Standard; Device: HD3SS3212RKS; PackageDescription: QFN, TEXAS Case Style RKS, 0.50mm Pitch, Rect.; 20 Pin, 2.50mm L X 4.50mm W X 1.00mm H body (w/Thermal Tab 1.1mm X 3.1mm); Part Description: Two-Channel Differential 2:1/1:2 USB3.1 Mux/Demux; Manufacturer Part Number: HD3SS3212RKS; Pin Count: 21; Case: TQFN20; Mounted: Yes; Socket: No; SMD: Yes; Sense: No; ComponentHeight: 1mm; Author: CERN DEM BC; HelpURL: \\cern.ch\dfs\Applications\Altium\Datasheets\HD3SS3212RKS.pdf; CreateDate: 2019-11-06; LatestRevisionDate: 2019-11-06
J3 = TYCO_1888247-1: 20 Position SFP+ Connector (Small Form-factor Pluggable); Part Description: 20 Position, Pitch 0.8mm SFP+ Receptacle (Small Form-factor Pluggable); Manufacturer: TYCO ELECTRONICS; PressFit: No; Part Number: TYCO_1888247-1; Component Kind: Standard; Component Type: Standard; Pin Count: 20; Family: SFP+; Mounted: Yes; Socket: No; SMD: Yes; Status: None; Manufacturer Part Number: 1888247-1; ComponentHeight: 5.4mm; HelpURL: \\cern.ch\dfs\Applications\Altium\Datasheets\TYCO_1888247-1.pdf; Author: CERN DEM JLC; CreateDate: 27-Feb-12; LatestRevisionDate: 27-Feb-12; Sense: No
L6 L7 = IND0805_MURATA_BLM21PG221SN1D: Inductor; Part Description: SMD EMIFIL Suppression Chip Ferrite Bead; Manufacturer: MURATA; Power: 2A; Resistance: 0.05R; Tolerance: ±25%; Part Number: IND0805_MURATA_BLM21PG221SN1D; Component Kind: Standard; Component Type: Standard; Pin Count: 2; Value: 220R@100MHz; Status: None; Manufacturer Part Number: BLM21PG221SN1D; Case: 0805; Mounted: Yes; Socket: No; SMD: Yes; Sense: No; ComponentHeight: 1.05mm; HelpURL: \\cern.ch\dfs\Applications\Altium\Datasheets\IND0805_MURATA_BLM21P.pdf; Author: CERN DEM JLC; CreateDate: 25/01/2010; LatestRevisionDate: 25/01/2010
LD13 = LED_AVAGO_HSME-C120: LED Green 1C 2A; Part Description: High Performance Right Angle Chip Green LED; Manufacturer: AVAGO TECHNOLOGIES; PressFit: No; Bonding: No; Part Number: LED_AVAGO_HSME-C120; Component Kind: Standard; Component Type: Standard; Color: Green; PackageDescription: Green Chip LED, 2-Leads, Body 1.7x1.1mm, Side Emitting Package; Manufacturer Part Number: HSME-C120; Pin Count: 2; Mounted: Yes; Socket: No; SMD: Yes; Sense: No; ComponentHeight: 0.7mm; HelpURL: \\cern.ch\dfs\Applications\Altium\Datasheets\LED_AVAGO_HSME-C120.pdf; ComponentLink1URL: \\cern.ch\dfs\Applications\Altium\Datasheets\LED_AVAGO_HSME-C110_DESIGN-GUIDE.pdf; ComponentLink1Description: Design Guide; Author: CERN DEM JMW; CreateDate: 22.07.2009; LatestRevisionDate: 20.06.2012
Plate1 = AMPHENOL_U77A11108000P: Plastic Dust Cover SFP Cage; PressFit: No; Part Number: AMPHENOL_U77A11108000P; Component Kind: Accessories; Component Type: Standard; Pin Count: 0; PackageDescription: Plastic Dust Cover SFP Cage; Mounted: Yes; Socket: No; SMD: No; Sense: No; Status: None; Value: Cover SFP; Part Description: Plastic Dust Cover SFP Cage; Manufacturer: AMPHENOL; Manufacturer Part Number: U77A11108000P; ComponentHeight: 10.2mm; HelpURL: \\cern.ch\dfs\Applications\Altium\Datasheets\AMPHENOL_U77A11108000P.pdf; Author: CERN DEM BC; CreateDate: 28.10.2019; LatestRevisionDate: 28.10.2019
R18 R118 R179 R180 R251-R253 R278 R284-R286 = R0402_10K_1%_0.0625W_100PPM: Resistor - 1%; Part Description: General Purpose Thick Film Chip Resistor; Manufacturer: GENERIC; Manufacturer1 Part Number: 232270671003L; TC: ±100ppm/°C; PressFit: No; Part Number: R0402_10K_1%_0.0625W_100PPM; Component Kind: Standard; Component Type: Standard; Pin Count: 2; Value: 10k; Status: Not Recommended; Power: 0.0625W; Manufacturer Part Number: R0402_10K_1%_0.0625W_100PPM; Case: 0402; Mounted: Yes; Sense: No; Socket: No; SMD: Yes; Manufacturer1 Example: YAGEO PHYCOMP; Manufacturer1 ComponentHeight: 0.4mm; HelpURL: \\cern.ch\dfs\Applications\Altium\Datasheets\R0402_Phycomp_RC0402.pdf; Author: CERN DEM JLC
  R18 R118 R251-R253 R284: CreateDate: 2007-12-03; LatestRevisionDate: 2012-10-17
  R179 R180 R278 R285 R286: Tolerance: ±1%; CreateDate: 03.12.2007; LatestRevisionDate: 17.10.2012
R26 = R0201_100R_1%_0.05W_200PPM: Resistor - 1%; Part Description: Thick Film Chip Resistor; Manufacturer: GENERIC; Manufacturer1 Part Number: CRCW0201100RFNED; Power: 0.05W; TC: ±200ppm/°C; PressFit: No; Part Number: R0201_100R_1%_0.05W_200PPM; Component Kind: Standard; Component Type: Standard; Pin Count: 2; Value: 100; Status: Not Recommended; Tolerance: ±1%; Manufacturer Part Number: R0201_100R_1%_0.05W_200PPM; Case: 0201; Mounted: Yes; Sense: No; Socket: No; SMD: Yes; Manufacturer1 Example: VISHAY; Manufacturer1 ComponentHeight: 0.27mm; HelpURL: \\cern.ch\dfs\Applications\Altium\Datasheets\R0201_VISHAY_CRCW e3.pdf; Author: CERN DEM JLC; CreateDate: 13.11.2014; LatestRevisionDate: 13.11.2014
R117 R254 = R0402_1K_1%_0.0625W_100PPM: as R76 on sheet FPGA_Bank_0_Supplies; Part Number: R0402_1K_1%_0.0625W_100PPM; Component Kind: Standard; Component Type: Standard; Pin Count: 2; Value: 1k; Status: Not Recommended; Power: 0.0625W; Tolerance: ±1%; Manufacturer Part Number: R0402_1K_1%_0.0625W_100PPM; Case: 0402; Mounted: Yes; Sense: No; Socket: No; SMD: Yes; Manufacturer1 Example: YAGEO PHYCOMP; Manufacturer1 ComponentHeight: 0.4mm; HelpURL: \\cern.ch\dfs\Applications\Altium\Datasheets\R0402_Phycomp_RC0402.pdf; Author: CERN DEM JLC; CreateDate: 2007-12-03; LatestRevisionDate: 2012-10-17
R287 = R0402_240R_1%_0.0625W_100PPM: Resistor - 1%; Part Description: General Purpose Thick Film Chip Resistor; Manufacturer: GENERIC; Manufacturer1 Part Number: 232270672401L; TC: ±100ppm/°C; PressFit: No; Part Number: R0402_240R_1%_0.0625W_100PPM; Component Kind: Standard; Component Type: Standard; Pin Count: 2; Value: 240; Status: Not Recommended; Power: 0.0625W; Tolerance: ±1%; Manufacturer Part Number: R0402_240R_1%_0.0625W_100PPM; Case: 0402; Mounted: Yes; Sense: No; Socket: No; SMD: Yes; Manufacturer1 Example: YAGEO PHYCOMP; Manufacturer1 ComponentHeight: 0.4mm; HelpURL: \\cern.ch\dfs\Applications\Altium\Datasheets\R0402_Phycomp_RC0402.pdf; Author: CERN DEM JLC; CreateDate: 03.12.2007; LatestRevisionDate: 17.10.2012
T17 T22 T23 = BSH103: as T16 on sheet FPGA_Bank_0_Supplies; Part Number: BSH103; Component Kind: Standard; Component Type: Standard; Device: BSH103; PackageDescription: SOT23, 3 pin, Pitch 0.95mm - 1.3mm W X 2.9mm L X 1.1mm H, IPC Medium Density; Manufacturer Part Number: BSH103; Pin Count: 3; Case: SOT23-3; Mounted: Yes; Socket: No; SMD: Yes; Sense: No; ComponentHeight: 1.1mm; HelpURL: \\cern.ch\dfs\Applications\Altium\Datasheets\BSH103.pdf; Author: CERN DEM JLC; CreateDate: 16.03.2010; LatestRevisionDate: 20.06.2017
  T17 T22: ClassName: Artix